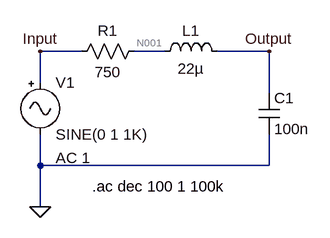
[diagram p0: schematic Circuito RLC.asc]
Circuito RLC.asc, the LTspice schematic file:
Version 4
SHEET 1 880 680
WIRE 208 64 144 64
WIRE 336 64 288 64
WIRE 496 64 416 64
WIRE 144 112 144 64
WIRE 496 128 496 64
WIRE 144 240 144 192
WIRE 496 240 496 192
WIRE 496 240 144 240
WIRE 144 304 144 240
FLAG 144 304 0
FLAG 144 64 Input
FLAG 496 64 Output
SYMBOL res 304 48 R90
WINDOW 0 0 56 VBottom 2
WINDOW 3 32 56 VTop 2
SYMATTR InstName R1
SYMATTR Value 750
SYMBOL cap 480 128 R0
SYMATTR InstName C1
SYMATTR Value 100n
SYMBOL ind 320 80 R270
WINDOW 0 32 56 VTop 2
WINDOW 3 5 56 VBottom 2
SYMATTR InstName L1
SYMATTR Value 22µ
SYMBOL Misc\\signal 144 96 R0
WINDOW 123 24 132 Left 2
WINDOW 39 0 0 Left 0
SYMATTR InstName V1
SYMATTR Value2 AC 1
TEXT 224 272 Left 2 !.ac dec 100 1 100k

The netlist it stands for:
* Circuito RLC.asc
R1 N001 Input 750
C1 Output 0 100n
L1 N001 Output 22µ
V1 Input 0 SINE(0 1 1K) AC 1
.ac dec 100 1 100k
.backanno
.end

* Results of the author's LTspice run, read from the files saved beside the schematic
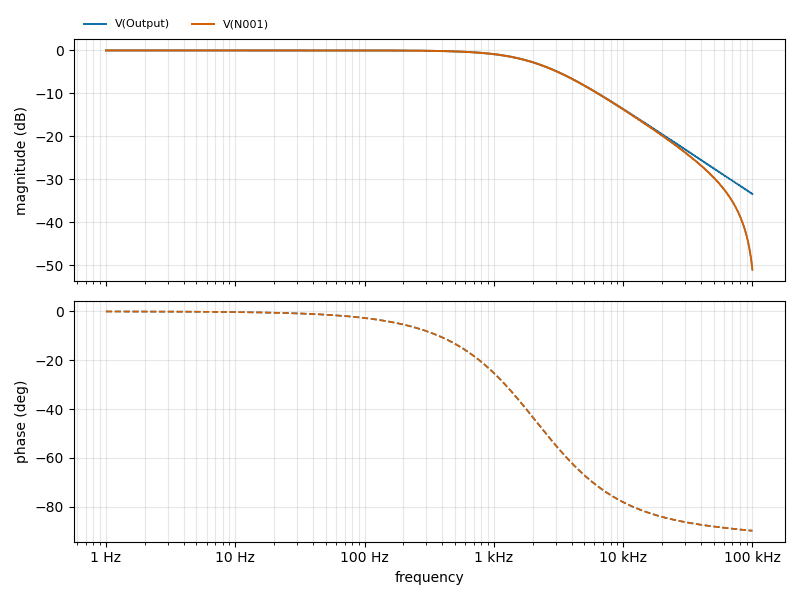
[diagram p1: AC Analysis of Circuito RLC.asc, plotted from the saved traces]
* AC Analysis, 1 run:
*   V(Output): -0.00 dB at 1 Hz, -33.46 dB at 100 kHz, peak -0.00 dB at 1 Hz, 3 dB below the peak at 2.123 kHz
*   V(N001): -0.00 dB at 1 Hz, -51.09 dB at 100 kHz, peak -0.00 dB at 1 Hz, 3 dB below the peak at 2.121 kHz